# EAGLE design ESP8266-SeeedBreakoutBoard (EAGLE 7.1.0)
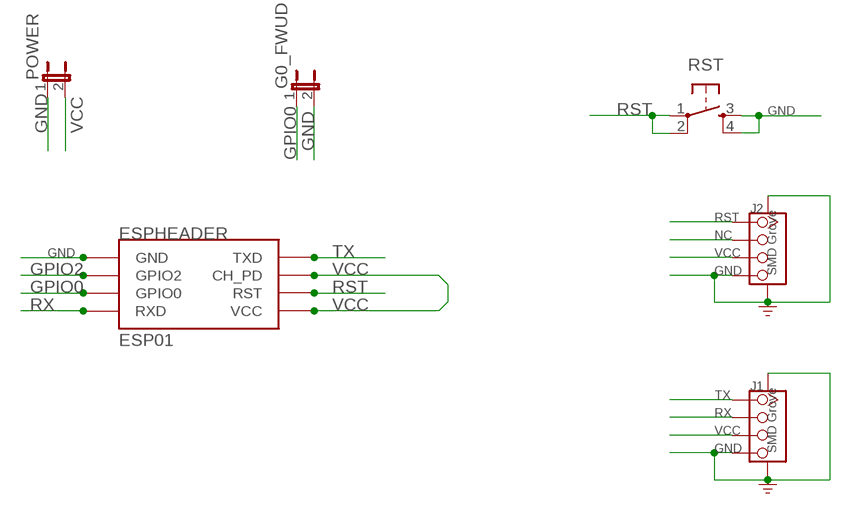
[diagram p0: schematic, sheet 1]

## Parts
ESPHEADER  ESP01  [ESP01]
G0_FWUD  JUMPER-2PTH  [1X02]
J1  SMD Grove  TWIG-4P-2.0-SMD-FEMALE-REINFORCE'DD'  [4P-SMD-2.0]
J2  SMD Grove  TWIG-4P-2.0-SMD-FEMALE-REINFORCE'DD'  [4P-SMD-2.0]
POWER  JUMPER-2PTH  [1X02]
RST  TAC_SWITCHPTH  [TACTILE-PTH]

## Nets
GND: ESPHEADER.GND G0_FWUD.2 J1.4 J1.SS1 J1.SS2 J2.4 J2.SS1 J2.SS2 POWER.1 RST.3 RST.4
GPIO0: ESPHEADER.GPIO0 G0_FWUD.1
GPIO2: ESPHEADER.GPIO2
NC: J2.2
RST: ESPHEADER.RST J2.1 RST.1 RST.2
RX: ESPHEADER.RX(RXD) J1.2
TX: ESPHEADER.TX(TXD) J1.1
VCC: ESPHEADER.CH_PD ESPHEADER.VCC J1.3 J2.3 POWER.2

## Library data of the parts
ESPHEADER = esp8266modules:ESP01: ESP8266 Wifi module 01
G0_FWUD POWER = SparkFun-Retired:JUMPER-2: Jumper Basic 0.1" spaced jumper. Use with breakaway headers.
J1 J2 = Connector:TWIG-4P-2.0-SMD-FEMALE-REINFORCE
RST = SparkFun-Electromechanical:TAC_SWITCH: Momentary Switch Button commonly used for reset or general input. Spark Fun Electronics SKU : COM-00097 SMT- SWCH-08247

## Board
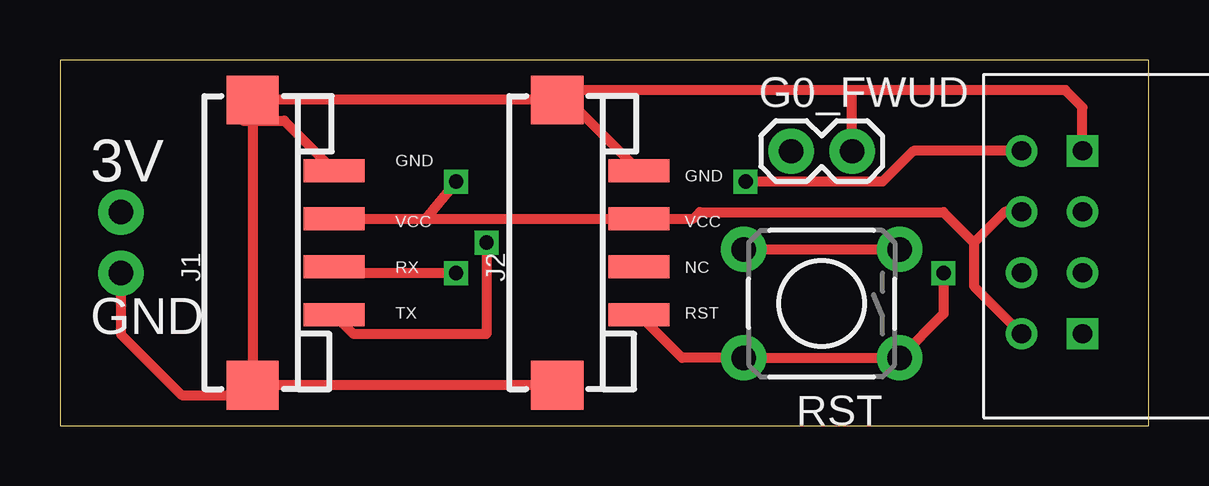
[diagram p1: board, top side]
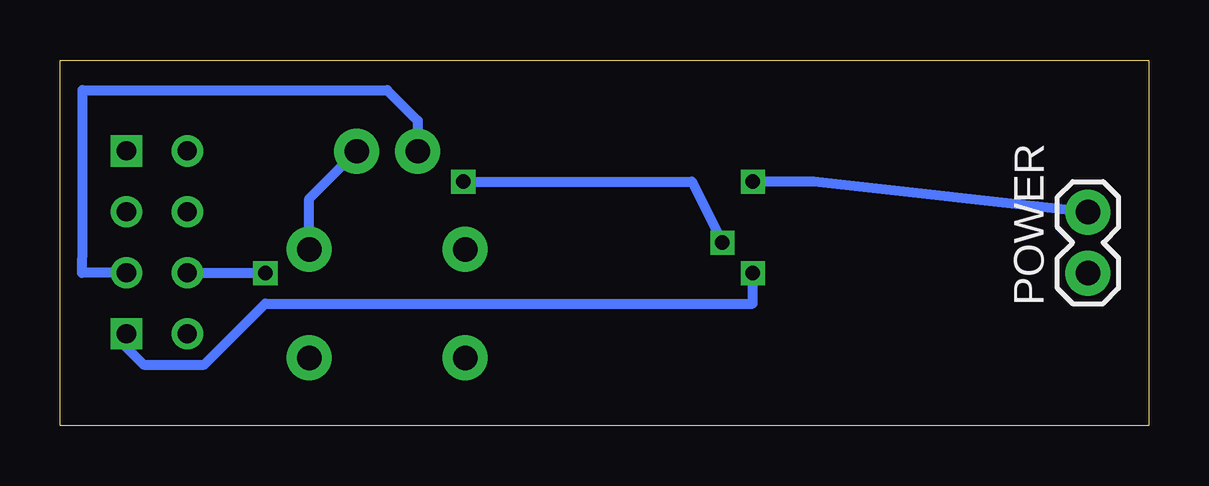
[diagram p2: board, bottom side, seen from below]

Size 45.39 x 15.23 mm. Coordinates in mm from the lower left corner, seen from the top.
Outline: 0,0 45.39,0 45.39,15.23 0,15.23 0,0
Copper layers (1*16): Top 0.035mm / dielectric 1.5mm / Bottom 0.035mm
Design rules "default": minimum track width 10mil, minimum drill 24mil, track to track 8mil, track to pad 8mil, pad to pad 8mil, via to via 8mil, smd to smd 8mil, copper to edge 40mil, drill to drill 8mil, minimum pad ring 10mil, minimum via ring 8mil, stop-mask expansion 4mil, vias tented up to drill 0mil, thermal gap 10mil

### Footprints (pad centres in the part's own frame; a part is rotated, then mirrored left to right if it is on the bottom)
ESP01 = drill 0.8: CH_PD -1.285,-8.178; GPIO0 1.255,-5.638; GPIO2 -1.285,-5.638; RST 1.255,-8.178; TX -3.825,-8.178; VCC 3.795,-8.178 | drill 0.8 square: GND -3.825,-5.638; RX 3.795,-5.638
1X02 = drill 1.016 pad 1.88: 1 0,0; 2 2.54,0
4P-SMD-2.0 = smd 0.965 x 2.54: 1 -3,0; 2 -1,0; 3 1,0; 4 3,0 | smd 2.032 x 2.184: SS1 -5.946,3.4; SS2 5.946,3.4
TACTILE-PTH = drill 1.016 pad 1.88: 1 -3.251,2.261; 2 3.251,2.261; 3 -3.251,-2.261; 4 3.251,-2.261

### Placement (x,y rotation side)
ESPHEADER  48.26,7.62 270 top
G0_FWUD  30.48,11.43 0 top
J1  11.43,7.62 90 top
J2  24.13,7.62 90 top
POWER  2.54,6.35 90 bottom
RST  31.75,5.08 180 top

### Tracks (layer width: path | path; a pad name or v marks a point on that pad's centre or on a via)
GND
  Top 0.406: 8.03,12.7 7.62,12.7 7.62,13.57 J1.SS2 J2.SS2 | 8.03,12.7 J1.SS1 | 8.03,12.7 9.35,12.7 J1.4 | J2.SS2 21.18,13.57 J2.4 | J2.SS1 J1.SS1 | ESPHEADER.GND 42.62,13.26 41.91,13.97 33.02,13.97 | 33.02,13.97 21.13,13.97 J2.SS2 | G0_FWUD.2 33.02,13.97 | RST.4 RST.3 | POWER.1 2.54,3.81 5.08,1.27 7.63,1.27 J1.SS1
  Bottom 0.406: RST.3 35,9.45 G0_FWUD.2
GPIO0
  Bottom 0.406: ESPHEADER.GPIO0 44.47,6.37 44.45,7.62 44.45,13.97 31.75,13.97 30.48,12.7 G0_FWUD.1
RST  (via drill 0.6)
  Top 0.406: J2.1 25.93,2.82 RST.2 RST.1 36.83,4.65 v36.83,6.35
  Bottom 0.406: ESPHEADER.RST 36.84,6.37 v36.83,6.35
RX  (via drill 0.6)
  Top 0.406: v16.51,6.35 11.7,6.35 J1.2
  Bottom 0.406: ESPHEADER.RX 42.62,3.25 41.91,2.54 39.37,2.54 36.83,5.08 16.51,5.08 v16.51,6.35
TX  (via drill 0.6)
  Top 0.406: ESPHEADER.TX 35.58,11.45 34.29,10.16 v28.58,10.16 | v17.78,7.62 17.78,3.81 12.24,3.81 J1.1
  Bottom 0.406: v28.58,10.16 19.05,10.16 v17.78,7.62
VCC  (via drill 0.6)
  Top 0.406: ESPHEADER.CH_PD 39.38,8.91 38.1,7.62 | 38.1,7.62 38.1,5.81 ESPHEADER.VCC | J1.3 15.24,8.62 | 15.24,8.62 J2.3 26.4,8.62 26.67,8.89 36.83,8.89 38.1,7.62 | v16.51,10.16 15.24,8.62
  Bottom 0.406: POWER.2 13.97,10.16 v16.51,10.16

### Text on the board
tNames: GND | 3V | GND | VCC | VCC | RX | NC | TX | RST | GND